# Altium project project_a_card.PrjPCB
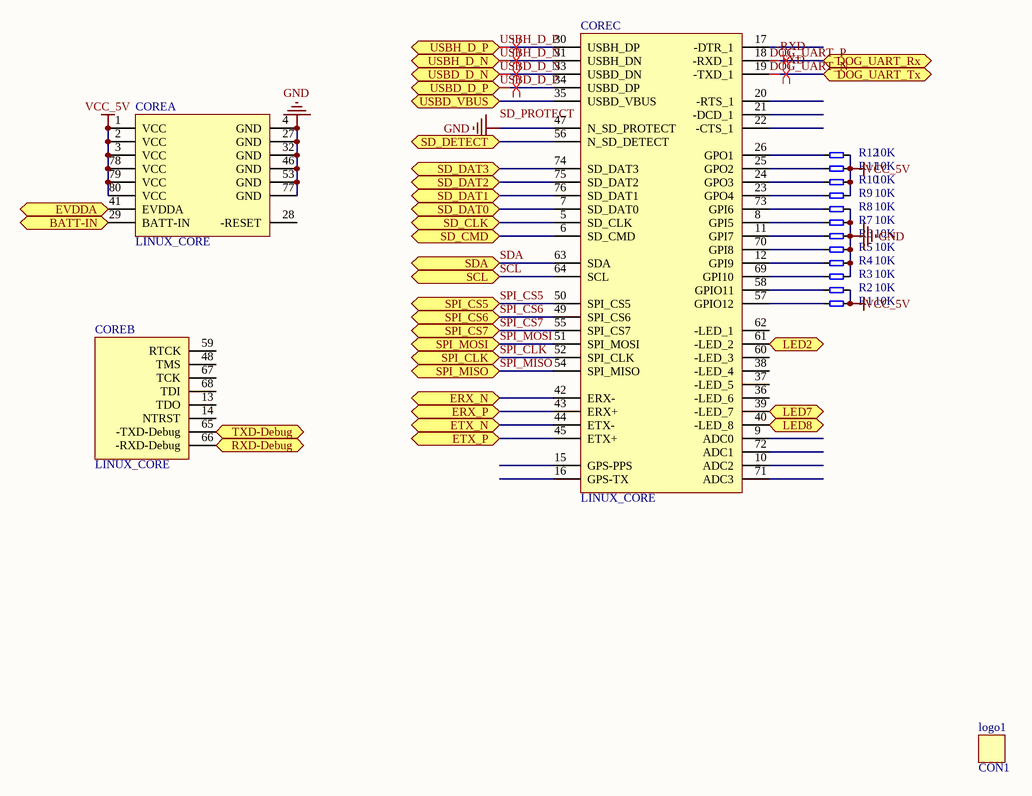
[diagram p0: core.SchDoc]
5 sheets, 117 parts. Net scope: flat (ports and power ports of the same name join across sheets).
Board file: pcb.PcbDoc
Sheets:
  core.SchDoc
  dog.SchDoc
  Power.SchDoc
  Interface.SchDoc
  Ethernet.SchDoc

## Sheet core.SchDoc: a_card
size A4; Author: 劉東輝; SheetNumber: 1; SheetTotal: 5; Unit: 核心板; Edition: V1.5

### Parts
CORE  LINUX_CORE  [LINUX_CORE]  (parts A,B,C of 3)
logo1  CON1  [logo]
R1  10K  [0805/2012 R3]
R2  10K  [0805/2012 R3]
R3  10K  [0805/2012 R3]
R4  10K  [0805/2012 R3]
R5  10K  [0805/2012 R3]
R6  10K  [0805/2012 R3]
R7  10K  [0805/2012 R3]
R8  10K  [0805/2012 R3]
R9  10K  [0805/2012 R3]
R10  10K  [0805/2012 R3]
R11  10K  [0805/2012 R3]
R12  10K  [0805/2012 R3]

### Ports
BATT-IN (bidir), DOG_UART_Rx (bidir), DOG_UART_Tx (bidir), ERX_N (bidir), ERX_P (bidir), ETX_N (bidir), ETX_P (bidir), EVDDA (bidir), LED2 (bidir), LED7 (bidir), LED8 (bidir), RXD-Debug (bidir), SCL (bidir), SD_CLK (bidir), SD_CMD (bidir), SD_DAT0 (bidir), SD_DAT1 (bidir), SD_DAT2 (bidir), SD_DAT3 (bidir), SD_DETECT (bidir), SDA (bidir), SPI_CLK (bidir), SPI_CS5 (bidir), SPI_CS6 (bidir), SPI_CS7 (bidir), SPI_MISO (bidir), SPI_MOSI (bidir), TXD-Debug (bidir), USBD_D_N (bidir), USBD_D_P (bidir), USBD_VBUS (bidir), USBH_D_N (bidir), USBH_D_P (bidir)

### Nets
GND: CORE.4(GND) CORE.27(GND) CORE.32(GND) CORE.46(GND) CORE.47(N_SD_PROTECT) CORE.53(GND) CORE.77(GND) R3.2 R4.2 R5.2 R6.2 R7.2 R8.2
VCC_5V: CORE.1(VCC) CORE.2(VCC) CORE.3(VCC) CORE.78(VCC) CORE.79(VCC) CORE.80(VCC) R1.2 R2.2 R9.2 R10.2 R11.2 R12.2
DOG_UART_N: CORE.19(-TXD_1) ; port DOG_UART_Tx
DOG_UART_P: CORE.18(-RXD_1) ; port DOG_UART_Rx
ERX_N: CORE.42(ERX-) ; port ERX_N
ERX_P: CORE.43(ERX+) ; port ERX_P
ETX_N: CORE.44(ETX-) ; port ETX_N
ETX_P: CORE.45(ETX+) ; port ETX_P
EVDDA: CORE.41(EVDDA) ; port EVDDA
SCL: CORE.64(SCL) ; port SCL
SDA: CORE.63(SDA) ; port SDA
SPI_CLK: CORE.52(SPI_CLK) ; port SPI_CLK
SPI_CS5: CORE.50(SPI_CS5) ; port SPI_CS5
SPI_CS6: CORE.49(SPI_CS6) ; port SPI_CS6
SPI_CS7: CORE.55(SPI_CS7) ; port SPI_CS7
SPI_MISO: CORE.54(SPI_MISO) ; port SPI_MISO
SPI_MOSI: CORE.51(SPI_MOSI) ; port SPI_MOSI
USBD_D_N: CORE.33(USBD_DN) ; port USBD_D_N
USBD_D_P: CORE.34(USBD_DP) ; port USBD_D_P
USBH_D_N: CORE.31(USBH_DN) ; port USBH_D_N
USBH_D_P: CORE.30(USBH_DP) ; port USBH_D_P
NetBT_2: CORE.29(BATT-IN) ; port BATT-IN
NetC5_2: CORE.35(USBD_VBUS) ; port USBD_VBUS
NetCORE_5: CORE.5(SD_CLK) ; port SD_CLK
NetCORE_6: CORE.6(SD_CMD) ; port SD_CMD
NetCORE_7: CORE.7(SD_DAT0) ; port SD_DAT0
NetCORE_8: CORE.8(GPI5) R7.1
NetCORE_11: CORE.11(GPI7) R6.1
NetCORE_12: CORE.12(GPI9) R4.1
NetCORE_23: CORE.23(GPO4) R9.1
NetCORE_24: CORE.24(GPO3) R10.1
NetCORE_25: CORE.25(GPO2) R11.1
NetCORE_26: CORE.26(GPO1) R12.1
NetCORE_39: CORE.39(-LED_7) ; port LED7
NetCORE_40: CORE.40(-LED_8) ; port LED8
NetCORE_56: CORE.56(N_SD_DETECT) ; port SD_DETECT
NetCORE_57: CORE.57(GPIO12) R1.1
NetCORE_58: CORE.58(GPIO11) R2.1
NetCORE_61: CORE.61(-LED_2) ; port LED2
NetCORE_65: CORE.65(-TXD-Debug) ; port TXD-Debug
NetCORE_66: CORE.66(-RXD-Debug) ; port RXD-Debug
NetCORE_69: CORE.69(GPI10) R3.1
NetCORE_70: CORE.70(GPI8) R5.1
NetCORE_73: CORE.73(GPI6) R8.1
NetCORE_74: CORE.74(SD_DAT3) ; port SD_DAT3
NetCORE_75: CORE.75(SD_DAT2) ; port SD_DAT2
NetCORE_76: CORE.76(SD_DAT1) ; port SD_DAT1

Not connected (* = marked no-connect by the designer): CORE 9(ADC0) 10(ADC2) 13(TDO) 14(NTRST) 15(GPS-PPS) 16(GPS-TX) 17(-DTR_1) 20(-RTS_1) 21(-DCD_1) 22(-CTS_1) 28(-RESET) 36(-LED_6) 37(-LED_5) 38(-LED_4) 48(TMS) 59(RTCK) 60(-LED_3) 62(-LED_1) 67(TCK) 68(TDI) 71(ADC3) 72(ADC1); logo1 1

### Layout directives
differential pair: DOG_UART_N, DOG_UART_P, USBD_D_N, USBD_D_P, USBH_D_N, USBH_D_P

### Notes on the sheet
- Labels drawn without touching a wire or pin: -RXD, -TXD, SD_PROTECT
- 项目:
- 作者:
- 总张数:
- 页码:
- 日期:
- 单元:
- 版本:

### Library data of the parts
logo1 = CON1: Connector
R1-R12 = RES2: Resistor

## Sheet dog.SchDoc: a_card
size A4; Author: 劉東輝; SheetNumber: 2; SheetTotal: 5; Unit: 看门狗; Edition: V1.5
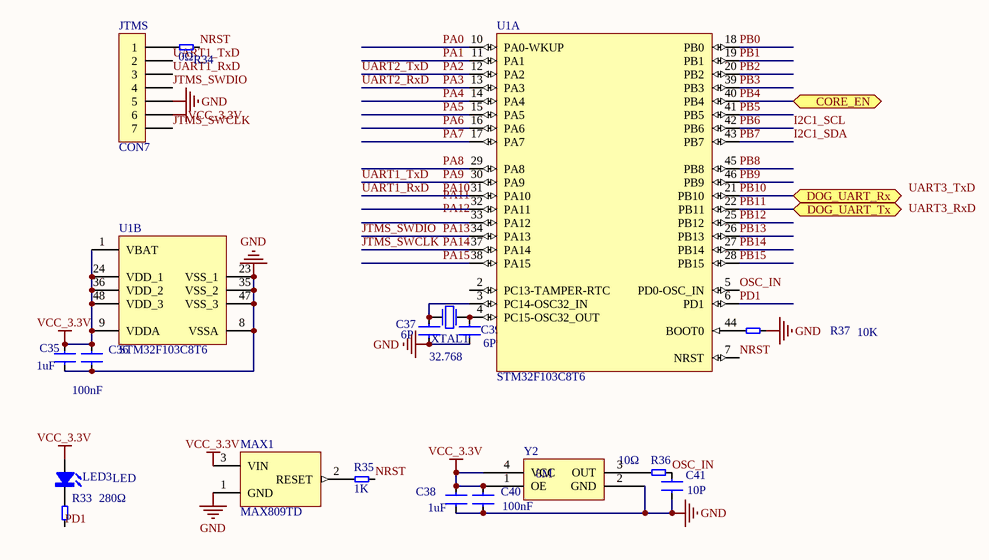
[diagram p1: dog.SchDoc]

### Parts
C35  1uF  [0805/2012 C3]
C36  100nF  [0805/2012 C3]
C37  6P  [0805/2012 C3]
C38  1uF  [0805/2012 C3]
C39  6P  [0805/2012 C3]
C40  100nF  [0805/2012 C3]
C41  10P  [0805/2012 C3]
JTMS  CON7  [JTMS]
LED3  LED  [0805/2012 LEDB]
MAX1  MAX809TD  [SOT-23 Q2]
R33  280Ω  [0805/2012 R3]
R34  0Ω  [0805/2012 R3]
R35  1K  [0805/2012 R3]
R36  10Ω  [0805/2012 R3]
R37  10K  [0805/2012 R3]
U1  STM32F103C8T6  [LQFP-48L]  (parts A,B of 2)
XTAL1  32.768  [Y_3215-2]
Y2  8M  [Y_3225-4]

### Ports
CORE_EN (bidir), DOG_UART_Rx (bidir), DOG_UART_Tx (bidir)

### Nets
GND: C35.1 C36.1 C37.1 C38.1 C39.1 C40.1 C41.1 JTMS.5 MAX1.1(GND) R37.2 U1.8(VSSA) U1.23(VSS_1) U1.35(VSS_2) U1.47(VSS_3) Y2.2(GND)
VCC_3.3V: C35.2 C36.2 C38.2 C40.2 JTMS.6 LED3.1(A) MAX1.3(VIN) U1.1(VBAT) U1.9(VDDA) U1.24(VDD_1) U1.36(VDD_2) U1.48(VDD_3) Y2.1(OE) Y2.4(VCC)
I2C1_SCL: U1.42(PB6)  [also labelled PB6]
I2C1_SDA: U1.43(PB7)  [also labelled PB7]
JTMS_SWCLK: JTMS.7 U1.37(PA14)  [also labelled PA14]
JTMS_SWDIO: JTMS.4 U1.34(PA13)  [also labelled PA13]
NRST: R34.2 R35.2 U1.7(NRST)
OSC_IN: C41.2 R36.1 U1.5(PD0-OSC_IN)
PA0: U1.10(PA0-WKUP)
PA1: U1.11(PA1)
PA2: U1.12(PA2)  [also labelled UART2_TxD]
PA3: U1.13(PA3)  [also labelled UART2_RxD]
PA4: U1.14(PA4)
PA5: U1.15(PA5)
PA6: U1.16(PA6)
PA7: U1.17(PA7)
PA8: U1.29(PA8)
PA9: JTMS.2 U1.30(PA9)  [also labelled UART1_TxD]
PA10: JTMS.3 U1.31(PA10)  [also labelled UART1_RxD]
PA15: U1.38(PA15)
PB0: U1.18(PB0)
PB1: U1.19(PB1)
PB2: U1.20(PB2)
PB3: U1.39(PB3)
PB4: U1.40(PB4) ; port CORE_EN
PB5: U1.41(PB5)
PB8: U1.45(PB8)
PB9: U1.46(PB9)
PB10: U1.21(PB10) ; port DOG_UART_Rx  [project net DOG_UART_P]
PB11: U1.22(PB11) ; port DOG_UART_Tx  [project net DOG_UART_N]
PB12: U1.25(PB12)
PB13: U1.26(PB13)
PB14: U1.27(PB14)
PB15: U1.28(PB15)
PD1: R33.2 U1.6(PD1)
NetC37_2: C37.2 U1.3(PC14-OSC32_IN) XTAL1.1(P1)
NetC39_2: C39.2 U1.4(PC15-OSC32_OUT) XTAL1.2(P2)
NetJTMS_1: JTMS.1 R34.1
NetLED3_2: LED3.2(K) R33.1
NetMAX1_2: MAX1.2(RESET) R35.1
NetR36_2: R36.2 Y2.3(OUT)
NetR37_1: R37.1 U1.44(BOOT0)

Not connected (* = marked no-connect by the designer): U1 2(PC13-TAMPER-RTC) 32(PA11) 33(PA12)

### Notes on the sheet
- Labels drawn without touching a wire or pin: PA11, PA12, UART3_RxD, UART3_TxD
- 项目:
- 作者:
- 总张数:
- 页码:
- 日期:
- 单元:
- 版本:

### Library data of the parts
C35 C38 = CAP4: 105
C36 C40 = CAP4: 104
C37 C39 C41 = CAP4: Capacitor
JTMS = CON7: 调试接口
LED3 = LED: 蓝; pin to pad: 1>2 2>1
MAX1 = MAX809/810: 复位芯片
R33-R37 = RES2: 精度5%
U1 = STM32F103C8T6: STM32 ARM-based 32-bit MCU Performance Line with 64 kB Flash, 20 kB Internal RAM, -40 to +85癈 Temperature, 48-Pin LQFP, Tray; DatasheetVersion: rev13.0, Apr-2011; PackageVersion: rev13, Apr-2011; PackageReference: LQFP48; PackageDescription: 48-Pin Low-Profile Quad Flat Pack, 7 x 7 mm Body, 0.5 mm Pitch (LQFP48); ComponentLink1Description: Manufacturer URL; ComponentLink1URL: http://www.st.com/; ComponentLink2Description: STM32F103 Datasheet; ComponentLink2URL: http://www.st.com/internet/com/TECHNICAL_RESOURCES/TECHNICAL_LITERATURE/DATASHEET/CD00161566.pdf; ComponentLink3Description: STM32 Family Web Page; ComponentLink3URL: www.st.com/stm32
XTAL1 = XTAL: 32.768晶体
Y2 = XTAL-SPXO: 8M有源晶振

## Sheet Power.SchDoc: a_card
size A4; Author: 劉東輝; SheetNumber: 4; SheetTotal: 5; Unit: 供电; Edition: V1.5
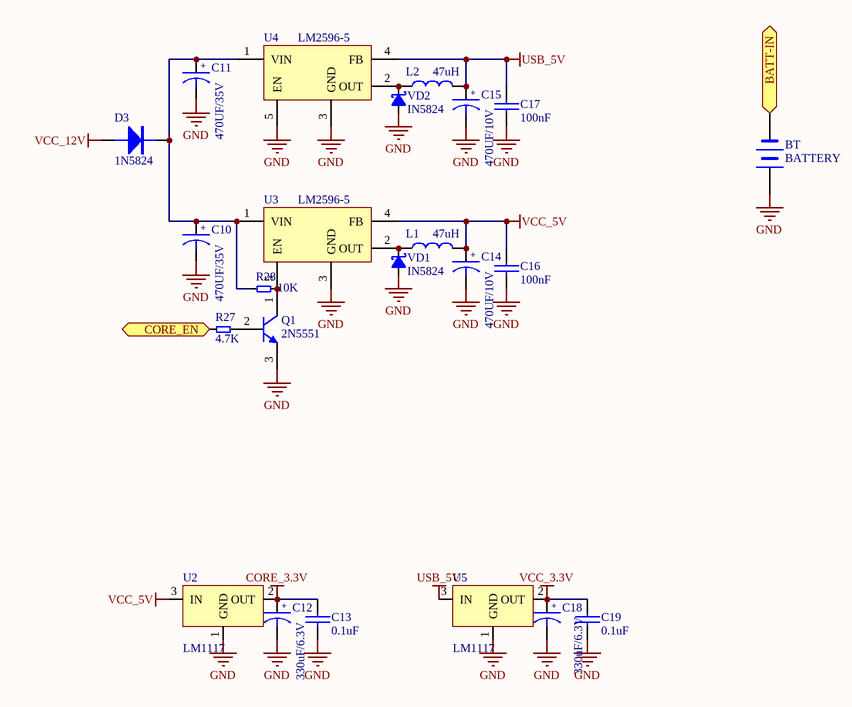
[diagram p2: Power.SchDoc]

### Parts
BT  BATTERY  [CR-1220]
C10  470UF/35V  [SMT_10X10_3-AECAP]
C11  470UF/35V  [SMT_10X10_3-AECAP]
C12  330uF/6.3V  [SMT_6_3X7_7-AECAP]
C13  0.1uF  [0805/2012 C3]
C14  470UF/10V  [SMT_6_3X7_7-AECAP]
C15  470UF/10V  [SMT_6_3X7_7-AECAP]
C16  100nF  [0805/2012 C3]
C17  100nF  [0805/2012 C3]
C18  330uF/6.3V  [SMT_6_3X7_7-AECAP]
C19  0.1uF  [0805/2012 C3]
D3  1N5824  [DO-214AC]
L1  47uH  [MS125]
L2  47uH  [MS125]
Q1  2N5551  [SOT-23 Q2]
R27  4.7K  [0805/2012 R3]
R28  10K  [0805/2012 R3]
U2  LM1117  [SOT-223]
U3  LM2596-5  [TO-263-5]
U4  LM2596-5  [TO-263-5]
U5  LM1117  [SOT-223]
VD1  IN5824  [DO-214AC]
VD2  IN5824  [DO-214AC]

### Ports
BATT-IN (bidir), CORE_EN (bidir)

### Nets
CORE_3.3V: C12.1 C13.1 U2.2(OUT) U2.4(OUT)
GND: BT.1(+) C10.2 C11.2 C12.2 C13.2 C14.2 C15.2 C16.2 C17.2 C18.2 C19.2 Q1.3(E) U2.1(GND) U3.3(GND) U4.3(GND) U4.5(EN) U5.1(GND) VD1.1(A) VD2.1(A)
USB_5V: C15.1 C17.1 L2.1 U4.4(FB) U5.3(IN)
VCC_3.3V: C18.1 C19.1 U5.2(OUT) U5.4
VCC_5V: C14.1 C16.1 L1.1 U2.3(IN) U3.4(FB)
VCC_12V: D3.1(A)
PB4: R27.1 ; port CORE_EN
NetBT_2: BT.2(-) ; port BATT-IN
NetC10_1: C10.1 C11.1 D3.2(K) R28.2 U3.1(VIN) U4.1(VIN)
NetL1_2: L1.2 U3.2(OUT) VD1.2(K)
NetL2_2: L2.2 U4.2(OUT) VD2.2(K)
NetQ1_1: Q1.1(C) R28.1 U3.5(EN)
NetQ1_2: Q1.2(B) R27.2

### Notes on the sheet
- 项目:
- 作者:
- 总张数:
- 页码:
- 日期:
- 单元:
- 版本:
- (in symbol 10UF/10V) +

### Library data of the parts
BT = BATTERY: pin to pad: 1>2 2>1
C10-C12 C14 C15 C18 = 10UF/10V: CCTC-106K010
C13 C19 = Pro39.tmp_22P_32
C16 C17 = Pro39.tmp_22P_32: 104
D3 = 1N5819: CD-1N5819-DO41; pin to pad: 1>2 2>1
L1 L2 = 100UH-SLF7032: 12*12电感
Q1 = NPN: NPN Bipolar Transistor; pin to pad: 1>3 2>1 3>2; Published: 8-Jun-2000; LatestRevisionDate: 17-Jul-2002; LatestRevisionNote: Re-released for DXP Platform.; PackageReference: TO-226-AA; Publisher: Altium Limited; PackageDescription: TO, Flat Index; 3 In-Line, Axial Leads; Body Dia. 4.8mm; Leads 0.55 x 0.51 mm (max); Code_JEDEC: TO-226-AA
R27 R28 = RES2: Resistor
U3 U4 = LM2596: LM2575/2596
VD1 VD2 = DIODE SCHOTTKY: 肖特基; pin to pad: 1>2 2>1

## Sheet Interface.SchDoc: a_card
size A4; Author: 劉東輝; SheetNumber: 5; SheetTotal: 5; Unit: 接口; Edition: V1.5
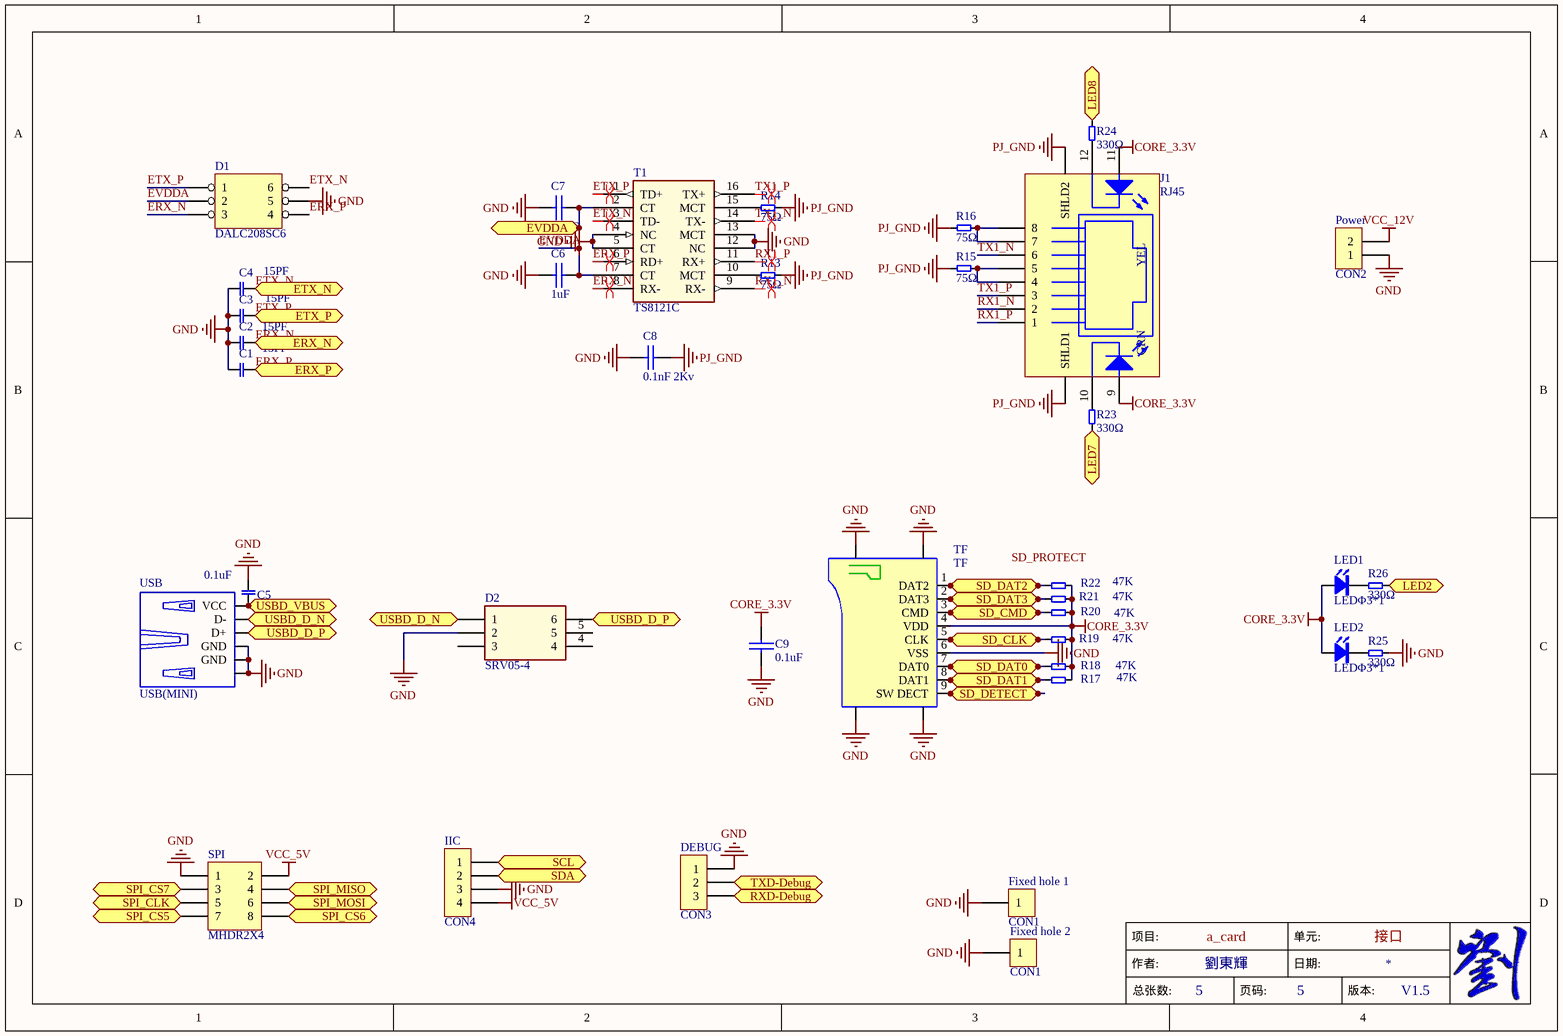
[diagram p3: Interface.SchDoc]

### Parts
C1  15PF  [0805/2012 C3]
C2  15PF  [0805/2012 C3]
C3  15PF  [0805/2012 C3]
C4  15PF  [0805/2012 C3]
C5  0.1uF  [0805/2012 C3]
C6  1uF  [0805/2012 C3]
C7  0.1uF  [0805/2012 C3]
C8  0.1nF 2Kv  [CAPRR508-350X650X700]
C9  0.1uF  [0805/2012 C3]
D1  DALC208SC6  [TSOT-23_6]
D2  SRV05-4  [TSOT-23_6]
DEBUG  CON3  [COMATEL_385.0358.1.03.400]
Fixed_hole_1  CON1  [CON_90]
Fixed_hole_2  CON1  [CON_90]
IIC  CON4  [COMATEL_385.0358.1.04.400]
J1  RJ45  [AMPHENOL_RJHSE-5381]
LED1  LEDΦ3*1  [LED_DIALIGHT_551-1307F]
LED2  LEDΦ3*1  [LED_DIALIGHT_551-1107F]
Power  CON2  [B2P-VH]
R13  75Ω  [0805/2012 R3]
R14  75Ω  [0805/2012 R3]
R15  75Ω  [0805/2012 R3]
R16  75Ω  [0805/2012 R3]
R17  47K  [0805/2012 R3]
R18  47K  [0805/2012 R3]
R19  47K  [0805/2012 R3]
R20  47K  [0805/2012 R3]
R21  47K  [0805/2012 R3]
R22  47K  [0805/2012 R3]
R23  330Ω  [0805/2012 R3]
R24  330Ω  [0805/2012 R3]
R25  330Ω  [0805/2012 R3]
R26  330Ω  [0805/2012 R3]
SPI  MHDR2X4  [M20N-2X04-2.54]
T1  TS8121C  [XFMR_PULSE_H1260NL]
TF  TF  [TFP09-2-12B-G]
USB  USB(MINI)  [WURTH_651005136521]

### Ports
ERX_N (bidir), ERX_P (bidir), ETX_N (bidir), ETX_P (bidir), EVDDA (bidir), LED2 (bidir), LED7 (bidir), LED8 (bidir), RXD-Debug (bidir), SCL (bidir), SD_CLK (bidir), SD_CMD (bidir), SD_DAT0 (bidir), SD_DAT1 (bidir), SD_DAT2 (bidir), SD_DAT3 (bidir), SD_DETECT (bidir), SDA (bidir), SPI_CLK (bidir), SPI_CS5 (bidir), SPI_CS6 (bidir), SPI_CS7 (bidir), SPI_MISO (bidir), SPI_MOSI (bidir), TXD-Debug (bidir), USBD_D_N (bidir), USBD_D_P (bidir), USBD_VBUS (bidir)

### Nets
CORE_3.3V: C9.1 J1.9 J1.11 LED1.1(1A) LED2.1(1A) R17.2 R18.2 R19.2 R20.2 R21.2 R22.2 TF.4(VDD)
GND: C1.2 C2.2 C3.1 C4.2 C5.1 C6.1 C7.1 C8.2 C9.2 D1.5 D2.2 DEBUG.1 Fixed_hole_1.1 Fixed_hole_2.1 IIC.3 Power.1 R25.2 SPI.1 T1.4(NC) T1.5(CT) T1.12(NC) T1.13(MCT) TF.6(VSS) TF.10(GND) TF.11(GND) TF.12(GND) TF.13(GND) USB.4(GND) USB.5(GND) USB.6
PJ_GND: C8.1 J1.13(SHLD2) R13.2 R14.2 R15.1 R16.1
VCC_5V: IIC.4 SPI.2
VCC_12V: Power.2
ERX_N: C2.1 D1.3 T1.8(RX-) ; port ERX_N
ERX_P: C1.1 D1.4 T1.6(RD+) ; port ERX_P
ETX_N: C4.1 D1.6 T1.3(TD-) ; port ETX_N
ETX_P: C3.2 D1.1 T1.1(TD+) ; port ETX_P
EVDDA: C6.2 C7.2 D1.2 T1.2(CT) T1.7(CT) ; port EVDDA
RX1_N: J1.2 T1.9(RX-)
RX1_P: J1.1 T1.11(RX+)
SCL: IIC.1 ; port SCL
SDA: IIC.2 ; port SDA
SPI_CLK: SPI.5 ; port SPI_CLK
SPI_CS5: SPI.7 ; port SPI_CS5
SPI_CS6: SPI.8 ; port SPI_CS6
SPI_CS7: SPI.3 ; port SPI_CS7
SPI_MISO: SPI.4 ; port SPI_MISO
SPI_MOSI: SPI.6 ; port SPI_MOSI
TX1_N: J1.6 T1.14(TX-)
TX1_P: J1.3 T1.16(TX+)
USBD_D_N: D2.1 USB.2(D-) ; port USBD_D_N
USBD_D_P: D2.6 USB.3(D+) ; port USBD_D_P
NetC5_2: C5.2 USB.1(VCC) ; port USBD_VBUS
NetCORE_5: R19.1 TF.5(CLK) ; port SD_CLK
NetCORE_6: R20.1 TF.3(CMD) ; port SD_CMD
NetCORE_7: R18.1 TF.7(DAT0) ; port SD_DAT0
NetCORE_39: R23.1 ; port LED7
NetCORE_40: R24.2 ; port LED8
NetCORE_56: TF.9(SW_DECT) ; port SD_DETECT
NetCORE_61: R26.2 ; port LED2
NetCORE_65: DEBUG.2 ; port TXD-Debug
NetCORE_66: DEBUG.3 ; port RXD-Debug
NetCORE_74: R21.1 TF.2(DAT3) ; port SD_DAT3
NetCORE_75: R22.1 TF.1(DAT2) ; port SD_DAT2
NetCORE_76: R17.1 TF.8(DAT1) ; port SD_DAT1
NetJ1_4: J1.4 J1.5 R15.2
NetJ1_7: J1.7 J1.8 R16.2
NetJ1_10: J1.10 R23.2
NetJ1_12: J1.12 R24.1
NetLED1_2: LED1.2(1K) R26.1
NetLED2_2: LED2.2(1K) R25.1
NetR13_1: R13.1 T1.10(MCT)
NetR14_1: R14.1 T1.15(MCT)

Not connected (* = marked no-connect by the designer): D2 3 4 5

### Layout directives
differential pair: ERX_N, ERX_P, ETX_N, ETX_P, RX1_N, RX1_P, TX1_N, TX1_P

### Notes on the sheet
- Labels drawn without touching a wire or pin: SD_PROTECT
- 项目:
- 作者:
- 总张数:
- 页码:
- 日期:
- 单元:
- 版本:
- (in symbol RJHSE-5381) YEL; GRN

### Library data of the parts
C1-C5 = CAP: Capacitor
C6-C9 = Pro39.tmp_22P_32
D1 = HEADER 3X2
DEBUG = CON3: Connector
Fixed_hole_1 Fixed_hole_2 = CON1: Connector
IIC = CON4: Connector
J1 = RJHSE-5381: 不带网络变压器; Part_Type: Connector; Manufacturer: XMultiple; Manufacturer_Part_Number: XMG-9799-8821-100D-L1TO-H-HIM; Internal_ID: 1001971; Symbol: RJ45_XMG-9799-8821; Component_Life_Cycle_State: Reviewed; Area: 337; Project: iMX6UL+PMIC; Digi_PN: 18000733; Package_Type: TH; ComponentLink1URL: //msp-file/public/Datasheet Repository/XMultiple/XMG-9799-8821-100D-L1TO-H-HIM.pdf; ComponentLink1Description: Manufacturer datasheet; ComponentLink2Description: Manufacturer Alt 1 datasheet; ComponentLink3Description: Manufacturer Alt 2 datasheet; ComponentLink4Description: Manufacturer Alt 3 datasheet; Height: 13,6; RoHS: 1
Power = CON2: Connector
R13-R26 = RES2: Resistor
SPI = MHDR2X4: Header, 4-Pin, Dual row
USB = USB(MINI): USB-MINI

## Sheet Ethernet.SchDoc: a_card
size A4; Author: 劉東輝; SheetNumber: 3; SheetTotal: 5; Unit: USB HUB; Edition: V1.5
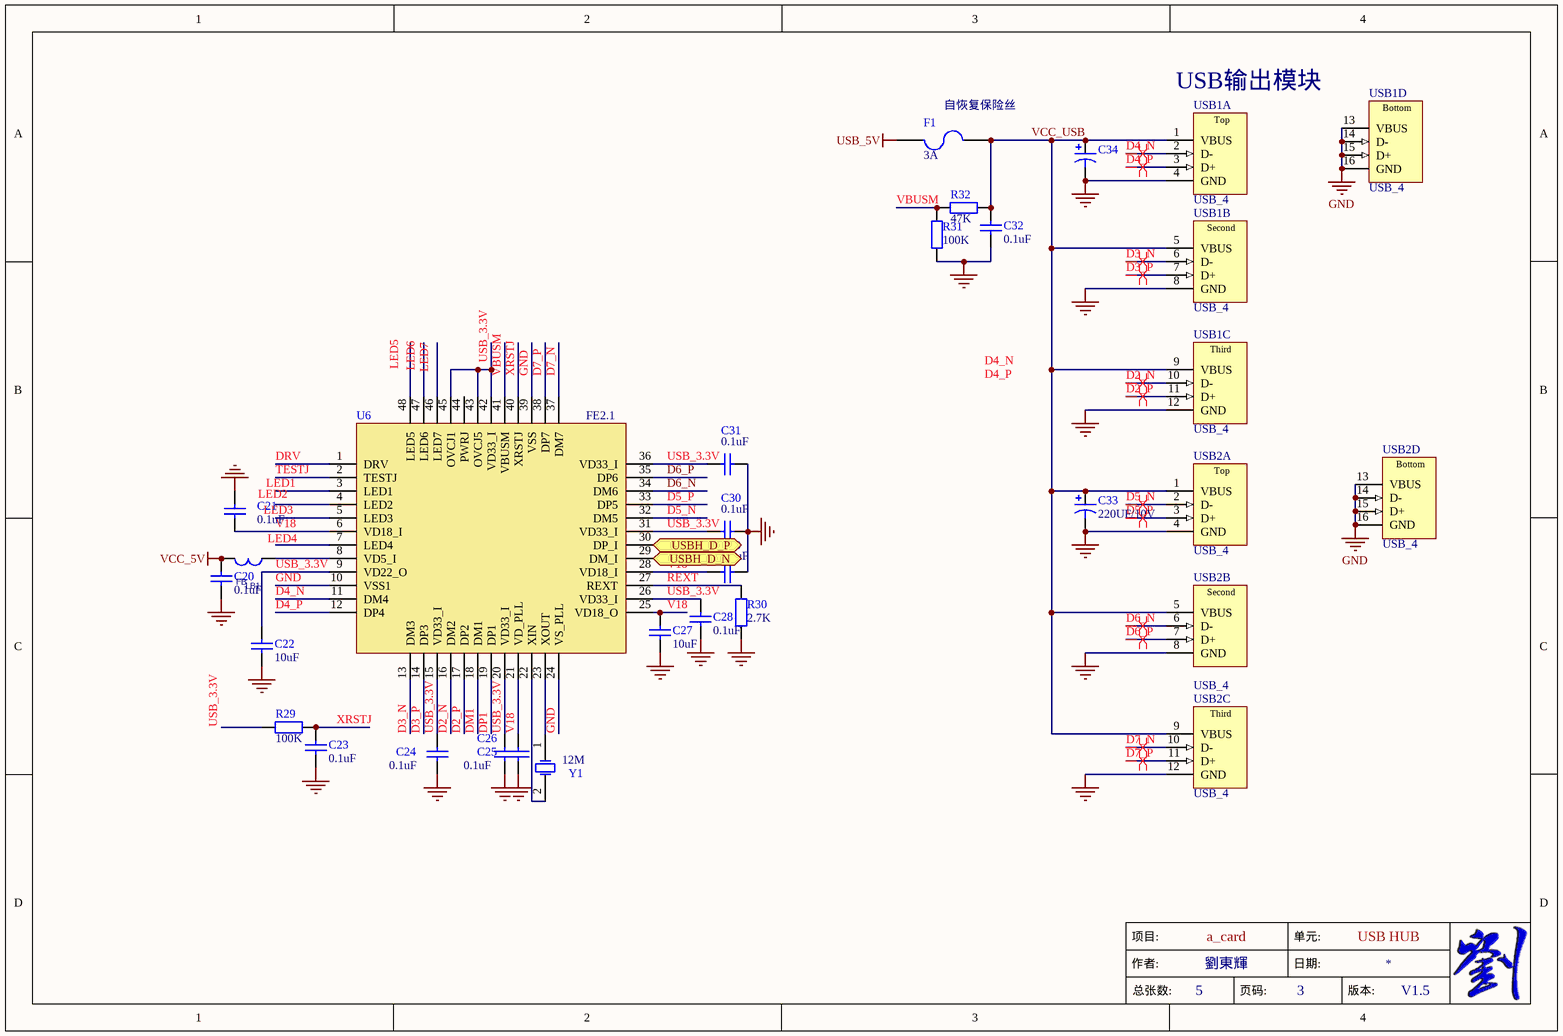
[diagram p4: Ethernet.SchDoc]

### Parts
C20  0.1uF  [0805/2012 C3]
C21  0.1uF  [0805/2012 C3]
C22  10uF  [0805/2012 C3]
C23  0.1uF  [0805/2012 C3]
C24  0.1uF  [0805/2012 C3]
C25  0.1uF  [0805/2012 C3]
C26  0.1uF  [0805/2012 C3]  (value not drawn)
C27  10uF  [0805/2012 C3]
C28  0.1uF  [0805/2012 C3]
C29  0.1uF  [0805/2012 C3]
C30  0.1uF  [0805/2012 C3]
C31  0.1uF  [0805/2012 C3]
C32  0.1uF  [0805/2012 C3]
C33  220UF/10V  [2312_6023-20_SMT-TAJ-F]
C34  220UF/10V  [2312_6023-20_SMT-TAJ-F]  (value not drawn)
F1  3A  [PPTC 1812/4532]
LB1  FB  [0805/2012 F3]
R29  100K  [0805/2012 R3]
R30  2.7K  [0805/2012 R3]
R31  100K  [0805/2012 R3]
R32  47K  [0805/2012 R3]
U6  FE2.1  [LQFP-48L]
USB1  USB_4  [USB-3]  (parts A,B,C,D of 5)
USB2  USB_4  [USB-3]  (parts A,B,C,D of 5)
Y1  12M  [XTAL_CITIZEN_HCM49]

### Ports
USBH_D_N (bidir), USBH_D_P (bidir)

### Nets
GND: C20.1 C21.1 C22.1 C23.1 C24.1 C25.1 C26.1 C27.1 C28.1 C29.1 C30.1 C31.1 C32.1 C33.2 C34.2 R30.1 R31.1 U6.10(VSS1) U6.24(VS_PLL) U6.39(VSS) USB1.4(GND) USB1.8(GND) USB1.12(GND) USB1.13(VBUS) USB1.14(D-) USB1.15(D+) USB1.16(GND) USB2.4(GND) USB2.8(GND) USB2.12(GND) USB2.13(VBUS) USB2.14(D-) USB2.15(D+) USB2.16(GND)
USB_5V: F1.2
VCC_5V: C20.2 LB1.2
D2_N: U6.16(DM2) USB1.10(D-)
D2_P: U6.17(DP2) USB1.11(D+)
D3_N: U6.13(DM3) USB1.6(D-)
D3_P: U6.14(DP3) USB1.7(D+)
D4_N: U6.11(DM4) USB1.2(D-)
D4_P: U6.12(DP4) USB1.3(D+)
D5_N: U6.32(DM5) USB2.2(D-)
D5_P: U6.33(DP5) USB2.3(D+)
D6_N: U6.34(DM6) USB2.6(D-)
D6_P: U6.35(DP6) USB2.7(D+)
D7_N: U6.37(DM7) USB2.10(D-)
D7_P: U6.38(DP7) USB2.11(D+)
DM1: U6.18(DM1)
DP1: U6.19(DP1)
DRV: U6.1(DRV)
REXT: R30.2 U6.27(REXT)
TESTJ: U6.2(TESTJ)
USB_3.3V: C22.2 C24.2 C25.2 C28.2 C30.2 C31.2 R29.1 U6.9(VD22_O) U6.15(VD33_I) U6.20(VD33_I) U6.26(VD33_I) U6.31(VD33_I) U6.36(VD33_I) U6.42(VD33_I) U6.43(OVCJ5) U6.45(OVCJ1)
USBH_D_N: U6.29(DM_I) ; port USBH_D_N
USBH_D_P: U6.30(DP_I) ; port USBH_D_P
V18: C21.2 C26.2 C27.2 C29.2 U6.6(VD18_I) U6.21(VD_PLL) U6.25(VD18_O) U6.28(VD18_I)
VBUSM: R31.2 R32.2 U6.41(VBUSM)
VCC_USB: C32.2 C33.1 C34.1 F1.1 R32.1 USB1.1(VBUS) USB1.5(VBUS) USB1.9(VBUS) USB2.1(VBUS) USB2.5(VBUS) USB2.9(VBUS)
XRSTJ: C23.2 R29.2 U6.40(XRSTJ)
NetLB1_1: LB1.1 U6.8(VD5_I)
NetU6_22: U6.22(XIN) Y1.2(OSC2)
NetU6_23: U6.23(XOUT) Y1.1(OSC1)

Not connected (* = marked no-connect by the designer): U6 3(LED1) 4(LED2) 5(LED3) 7(LED4) 44(PWRJ) 46(LED7) 47(LED6) 48(LED5)

### Layout directives
differential pair: D2_N, D2_P, D3_N, D3_P, D4_N, D4_P, D5_N, D5_P, D6_N, D6_P, D7_N, D7_P

### Notes on the sheet
- (near F1) 自恢复保险丝
- (near USB1) USB输出模块
- Labels drawn without touching a wire or pin: D4_N, D4_P, LED1, LED2, LED3, LED4, LED5, LED6, LED7
- 项目:
- 作者:
- 总张数:
- 页码:
- 日期:
- 单元:
- 版本:
- (in symbol USB_4, part A) Top
- (in symbol USB_4, part B) Second
- (in symbol USB_4, part C) Third
- (in symbol USB_4, part D) Bottom

### Library data of the parts
C20-C32 = Cap: Capacitor
  C20-C22 C24 C27 C30: Published: *; LatestRevisionDate: *; LatestRevisionNote: *; PackageReference: *; Publisher: *; Value: *
  C23 C25 C26 C28 C29 C31 C32: Published: 8-Jun-2000; LatestRevisionDate: 17-Jul-2002; LatestRevisionNote: Re-released for DXP Platform.; PackageReference: RAD-0.3; Publisher: Altium Limited
C33 C34 = Cap Pol1: Polarized Capacitor (Radial)
  C33: Published: 8-Jun-2000; LatestRevisionDate: 17-Jul-2002; LatestRevisionNote: Re-released for DXP Platform.; PackageReference: RB7.6-15; Publisher: Altium Limited
  C34: Published: *; LatestRevisionDate: *; LatestRevisionNote: *; PackageReference: *; Publisher: *; Value: *
F1 = Fuse 2: Fuse; Published: 8-Jun-2000; LatestRevisionDate: 17-Jul-2002; LatestRevisionNote: Re-released for DXP Platform.; PackageReference: PIN-W2/E2.8; Publisher: Altium Limited
LB1 = FB-0805
R29-R32 = Res2: Resistor
  R29 R31 R32: Published: 8-Jun-2000; LatestRevisionDate: 17-Jul-2002; LatestRevisionNote: Re-released for DXP Platform.; PackageReference: AXIAL-0.4; Publisher: Altium Limited
  R30: Published: *; LatestRevisionDate: *; LatestRevisionNote: *; PackageReference: *; Publisher: *; Value: *
U6 = F2.1
USB1 USB2 = USB_4: USB 1.1, Right Angle, Thru-Hole, A Type, Receptacle, 4x4x4x4 Position, Fourfold Stacked, Black; ContactMaterial: Phosphor Bronze; ContactPlating: Gold (30) over Nickel (50); TerminationLength: 2.36mm [0.093in.]; PCB_Layout: Complies with manufacturer's recommendation.; DrillSize: Corresponds to nominal value.; PanelGround: Without; Published: 15-Jul-2004; DatasheetDocument: 30-Jul-2002; PackageDocument: 30-Jul-2002; PackageReference: 1470007; Publisher: Altium Limited; HousingMaterial: 30% Glass-Filled Thermoplastic; ComponentLink1Description: Manufacturer Link; ComponentLink1URL: http://www.tycoelectronics.com/; ComponentLink2Description: Packaging Specification; ComponentLink2URL: http://ecommas.tycoelectronics.com/commerce/DocumentDelivery/DDEController?Action=showdoc&DocId=Customer+Drawing%7F1470007%7FO%7Fpdf%7FEnglish%7FENG_CD_1470007_O.pdf
Y1 = XTAL: Crystal Oscillator; Published: *; LatestRevisionDate: *; LatestRevisionNote: *; PackageReference: *; Publisher: *

## Nets that join several sheets
CORE_3.3V: Power (C12.1 C13.1 U2.2 U2.4), Interface (12 pins)
GND: core (13 pins), dog (15 pins), Power (19 pins), Interface (30 pins), Ethernet (34 pins)
USB_5V: Power (5 pins), Ethernet (F1.2)
VCC_3.3V: dog (14 pins), Power (C18.1 C19.1 U5.2 U5.4)
VCC_5V: core (12 pins), Power (5 pins), Interface (IIC.4 SPI.2), Ethernet (C20.2 LB1.2)
VCC_12V: Power (D3.1), Interface (Power.2)
DOG_UART_N: core (CORE.19), dog (U1.22)
DOG_UART_P: core (CORE.18), dog (U1.21)
ERX_N: core (CORE.42), Interface (C2.1 D1.3 T1.8)
ERX_P: core (CORE.43), Interface (C1.1 D1.4 T1.6)
ETX_N: core (CORE.44), Interface (C4.1 D1.6 T1.3)
ETX_P: core (CORE.45), Interface (C3.2 D1.1 T1.1)
EVDDA: core (CORE.41), Interface (5 pins)
NetBT_2: core (CORE.29), Power (BT.2)
NetC5_2: core (CORE.35), Interface (C5.2 USB.1)
NetCORE_5: core (CORE.5), Interface (R19.1 TF.5)
NetCORE_6: core (CORE.6), Interface (R20.1 TF.3)
NetCORE_7: core (CORE.7), Interface (R18.1 TF.7)
NetCORE_39: core (CORE.39), Interface (R23.1)
NetCORE_40: core (CORE.40), Interface (R24.2)
NetCORE_56: core (CORE.56), Interface (TF.9)
NetCORE_61: core (CORE.61), Interface (R26.2)
NetCORE_65: core (CORE.65), Interface (DEBUG.2)
NetCORE_66: core (CORE.66), Interface (DEBUG.3)
NetCORE_74: core (CORE.74), Interface (R21.1 TF.2)
NetCORE_75: core (CORE.75), Interface (R22.1 TF.1)
NetCORE_76: core (CORE.76), Interface (R17.1 TF.8)
PB4: dog (U1.40), Power (R27.1)
SCL: core (CORE.64), Interface (IIC.1)
SDA: core (CORE.63), Interface (IIC.2)
SPI_CLK: core (CORE.52), Interface (SPI.5)
SPI_CS5: core (CORE.50), Interface (SPI.7)
SPI_CS6: core (CORE.49), Interface (SPI.8)
SPI_CS7: core (CORE.55), Interface (SPI.3)
SPI_MISO: core (CORE.54), Interface (SPI.4)
SPI_MOSI: core (CORE.51), Interface (SPI.6)
USBD_D_N: core (CORE.33), Interface (D2.1 USB.2)
USBD_D_P: core (CORE.34), Interface (D2.6 USB.3)
USBH_D_N: core (CORE.31), Ethernet (U6.29)
USBH_D_P: core (CORE.30), Ethernet (U6.30)